# Altium project 电子脚扣终端主控板.PrjPcb
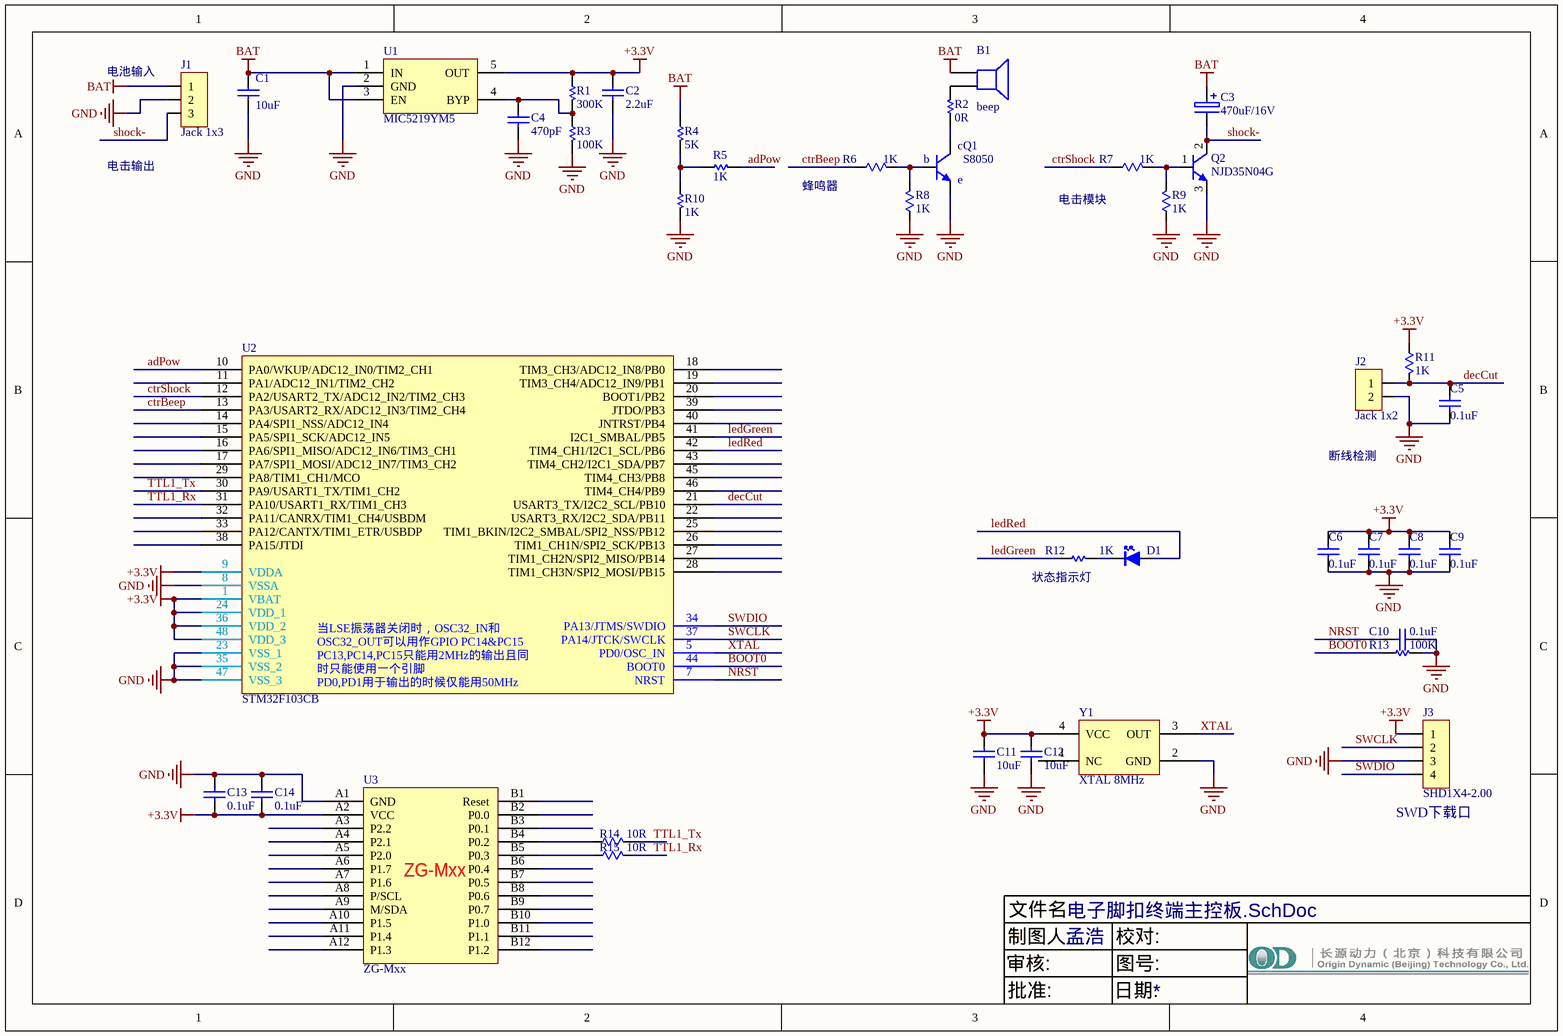
[diagram p0: 电子脚扣终端主控板.SchDoc]
1 sheet, 40 parts. Net scope: global (net labels, ports and power ports of the same name join across sheets).
Board file: 电子脚扣终端主控板.PcbDoc

## Sheet 电子脚扣终端主控板.SchDoc
size A4

### Parts
B1  beep  [Jk1*2-2.0]
C1  10uF  [C0603]
C2  2.2uF  [C0603]
C3  470uF/16V  [Jk1*2-2.0]
C4  470pF  [C0603]
C5  0.1uF  [C0603]
C6  0.1uF  [C0603]
C7  0.1uF  [C0603]
C8  0.1uF  [C0603]
C9  0.1uF  [C0603]
C10  0.1uF  [C0603]
C11  10uF  [C0603]
C12  10uF  [C0603]
C13  0.1uF  [C0603]
C14  0.1uF  [C0603]
D1  LED  [Led-D3]  (value not drawn)
J1  Jack 1x3  [Jk1*3-2.0]
J2  Jack 1x2  [Jk1*2-2.0]
J3  SHD1X4-2.00  [Jk1*4-2.0]
Q1  S8050  [SOT-23]
Q2  NJD35N04G  [TO-252]
R1  300K  [R0603]
R2  0R  [R0603]
R3  100K  [R0603]
R4  5K  [R0603]
R5  1K  [R0603]
R6  1K  [R0603]
R7  1K  [R0603]
R8  1K  [R0603]
R9  1K  [R0603]
R10  1K  [R0603]
R11  1K  [R0603]
R12  1K  [R0603]
R13  100K  [R0603]
R14  10R  [R0603]
R15  10R  [R0603]
U1  MIC5219YM5  [SOT-23-5]
U2  STM32F103CB  [LQF48]
U3  ZG-Mxx  [ZG-M0]
Y1  XTAL 8MHz  [XTAL5032]

### Nets
+3.3V: C2.1 C6.1 C7.1 C8.1 C9.1 C11.2 C12.2 C13.1 C14.1 J3.1 R1.1 R11.1 U1.5(OUT) U2.1(VBAT) U2.9(VDDA) U2.24(VDD_1) U2.36(VDD_2) U2.48(VDD_3) U3.A2(VCC) Y1.4(VCC)
BAT: B1.1 C1.2 C3.1 J1.1 R4.1 U1.1(IN) U1.3(EN)
GND: C1.1 C2.2 C4.2 C5.2 C6.2 C7.2 C8.2 C9.2 C10.2 C11.1 C12.1 C13.2 C14.2 J1.2 J2.2 J3.3 Q1.2(e) Q2.3(E) R3.2 R8.1 R9.1 R10.2 R13.2 U1.2(GND) U2.8(VSSA) U2.23(VSS_1) U2.35(VSS_2) U2.47(VSS_3) U3.A1(GND) Y1.2(GND)
adPow: R5.2 U2.10(PA0/WKUP/ADC12_IN0/TIM2_CH1)
BOOT0: R13.1 U2.44(BOOT0)
ctrBeep: R6.1 U2.13(PA3/USART2_RX/ADC12_IN3/TIM2_CH4)
ctrShock: R7.1 U2.12(PA2/USART2_TX/ADC12_IN2/TIM2_CH3)
decCut: C5.1 J2.1 R11.2 U2.21(USART3_TX/I2C2_SCL/PB10)
ledGreen: R12.1 U2.41(I2C1_SMBAL/PB5)
ledRed: D1.1(A) U2.42(TIM4_CH1/I2C1_SCL/PB6)
NRST: C10.1 U2.7(NRST)
shock-: C3.2 J1.3 Q2.2(C)
SWCLK: J3.2 U2.37(PA14/JTCK/SWCLK)
SWDIO: J3.4 U2.34(PA13/JTMS/SWDIO)
TTL1_Rx: R15.1 U2.31(PA10/USART1_RX/TIM1_CH3)
TTL1_Tx: R14.1 U2.30(PA9/USART1_TX/TIM1_CH2)
XTAL: U2.5(PD0/OSC_IN) Y1.3(OUT)
NetB1_2: B1.2 R2.2
NetC4_1: C4.1 R1.2 R3.1 U1.4(BYP)
NetD1_2: D1.2(K) R12.2
NetQ1_1: Q1.1(b) R6.2 R8.2
NetQ1_3: Q1.3(c) R2.1
NetQ2_1: Q2.1(B) R7.2 R9.2
NetR4_2: R4.2 R5.1 R10.1
NetR14_2: R14.2 U3.B4(P0.2)
NetR15_2: R15.2 U3.B5(P0.3)

Not connected (* = marked no-connect by the designer): U2 2(PC13-TAMPER-RTC) 3(PC14-OSC32_IN) 4(PC15-OSC32_OUT) 6(PD1/OSC_OUT) 11(PA1/ADC12_IN1/TIM2_CH2) 14(PA4/SPI1_NSS/ADC12_IN4) 15(PA5/SPI1_SCK/ADC12_IN5) 16(PA6/SPI1_MISO/ADC12_IN6/TIM3_CH1) 17(PA7/SPI1_MOSI/ADC12_IN7/TIM3_CH2) 18(TIM3_CH3/ADC12_IN8/PB0) 19(TIM3_CH4/ADC12_IN9/PB1) 20(BOOT1/PB2) 22(USART3_RX/I2C2_SDA/PB11) 25(TIM1_BKIN/I2C2_SMBAL/SPI2_NSS/PB12) 26(TIM1_CH1N/SPI2_SCK/PB13) 27(TIM1_CH2N/SPI2_MISO/PB14) 28(TIM1_CH3N/SPI2_MOSI/PB15) 29(PA8/TIM1_CH1/MCO) 32(PA11/CANRX/TIM1_CH4/USBDM) 33(PA12/CANTX/TIM1_ETR/USBDP) 38(PA15/JTDI) 39(JTDO/PB3) 40(JNTRST/PB4) 43(TIM4_CH2/I2C1_SDA/PB7) 45(TIM4_CH3/PB8) 46(TIM4_CH4/PB9); U3 A3(P2.2) A4(P2.1) A5(P2.0) A6(P1.7) A7(P1.6) A8(P/SCL) A9(M/SDA) A10(P1.5) A11(P1.4) A12(P1.3) B1(Reset) B2(P0.0) B3(P0.1) B6(P0.4) B7(P0.5) B8(P0.6) B9(P0.7) B10(P1.0) B11(P1.1) B12(P1.2); Y1 1(NC)

### Notes on the sheet
- (near J1) 电池输入
- 电击输出
- 蜂鸣器
- (near R7) 电击模块
- 断线检测
- (near R12) 状态指示灯
- (near J3) SWD下载口
- 文件名:
- 审核:
- 制图人:
- 孟浩
- 校对:
- 图号:
- 批准:
- 日期:
- (in symbol STM32F103Cx) OSC32_IN和OSC32_OUT可以用作通用IO PC14和PC15; PC13,PC14,PC15只能用于2MHz的输出模式且同时只能使用一个引脚; 当LSE振荡器关闭时，OSC32_IN和OSC32_OUT可以用作GPIO PC14&PC15 / PC13,PC14,PC15只能用2MHz的输出且同时只能使用一个引脚 / PD0,PD1用于输出的时候仅能用50MHz

### Library data of the parts
B1 = Speaker: Loudspeaker; Published: 24-Mar-1999; LatestRevisionDate: 17-Jul-2002; LatestRevisionNote: Re-released for DXP Platform.; PackageReference: PIN2; Publisher: Altium Limited
C1 C5-C12 = Cap Semi
C2 C4 = CAP: Published: 8-Jun-2000; LatestRevisionDate: 17-Jul-2002; LatestRevisionNote: Re-released for DXP Platform.; PackageReference: RAD-0.3; Publisher: Altium Limited
  C2: Value: 2.2uF
  C4: Value: 470pF
C3 = Cap Poll
C13 C14 = Cap: Capacitor; Published: 8-Jun-2000; Revision: July-2002: Re-released for DXP Platform.; Publisher: Altium Limited; Value: 0.1uF
J1 = Jack 1x3: 插座
J2 = Jack 1x2: 插座
J3 = HEADER1X4
Q1 = S8050: NPN triode, 0.5A Max
Q2 = MJD122
R1-R5 R10 R12 R13 = Res
R6-R9 R11 = RES: Resistor; Published: 8-Jun-2000; LatestRevisionDate: 17-Jul-2002; LatestRevisionNote: Re-released for DXP Platform.; PackageReference: AXIAL-0.3; Publisher: Altium Limited; Value: 1K
R14 R15 = Res: Resistor; Published: 8-Jun-2000; LatestRevisionDate: 04-Mar-2005; LatestRevisionNote: PCB Footprint replaced.; PackageReference: J1-0603; Publisher: Altium Limited; Value: 10R
U1 = MIC5205
U2 = STM32F103Cx
Y1 = XTAL